# EAGLE design Turing_mini_expander (EAGLE 7.4.0)

## Sheet 1 of 2
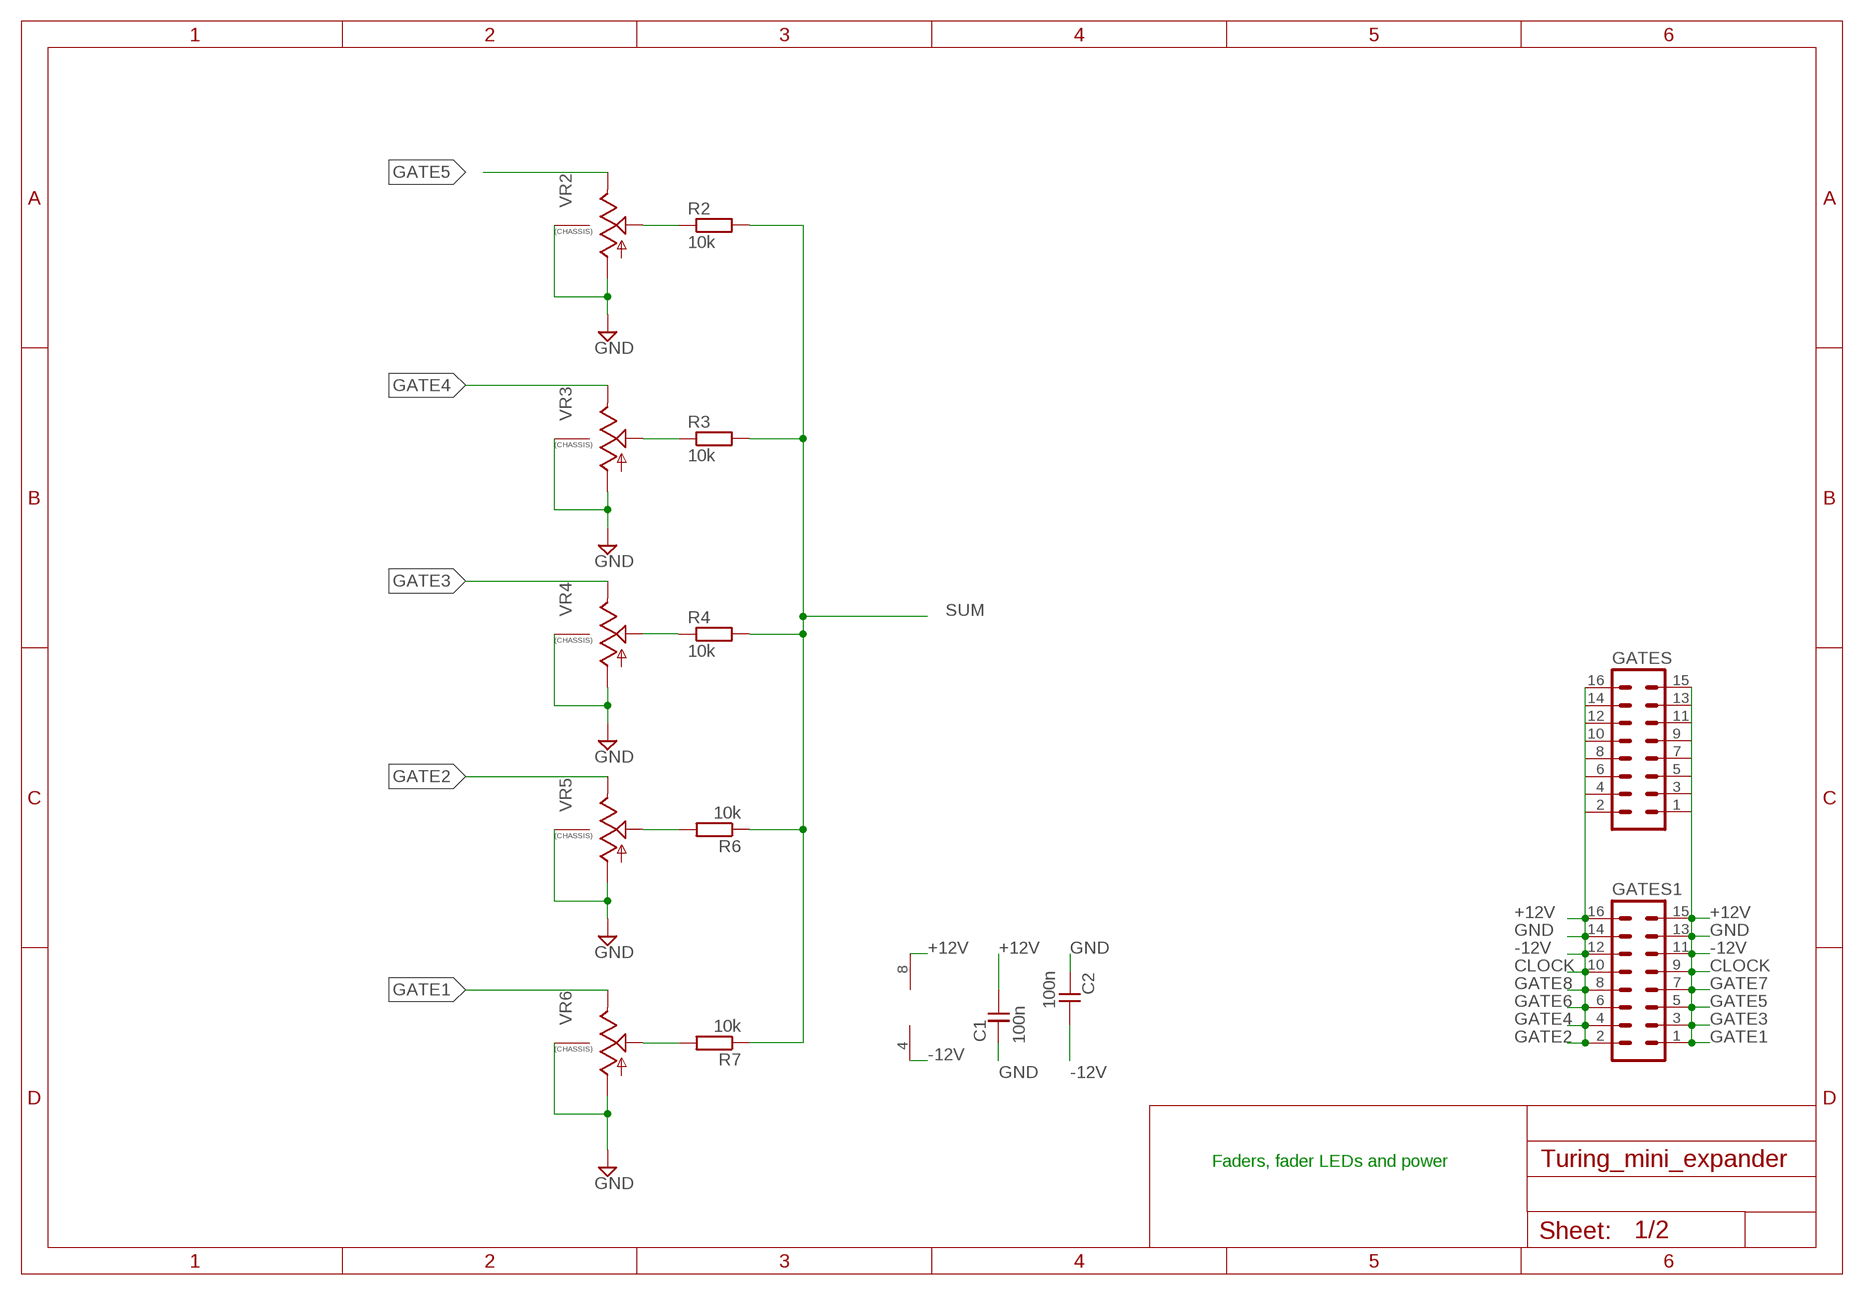
[diagram p0: schematic, sheet 1]

### Parts
C1  100n  C-EU050-024X044  [C050-024X044]
C2  100n  C-EU050-024X044  [C050-024X044]
GATES  MA08-2  [MA08-2]
GATES1  MA08-2  [MA08-2]
R2  10k  RESISTOR7MM  [7MM_RESISTOR]
R3  10k  RESISTOR7MM  [7MM_RESISTOR]
R4  10k  RESISTOR7MM  [7MM_RESISTOR]
R6  10k  RESISTOR7MM  [7MM_RESISTOR]
R7  10k  RESISTOR7MM  [7MM_RESISTOR]
U1  TL072_  [DIL08]
VR2  9MM_SNAP-IN_POT_CHASSIS  [9MM_SNAP-IN_POT]
VR3  9MM_SNAP-IN_POT_CHASSIS  [9MM_SNAP-IN_POT]
VR4  9MM_SNAP-IN_POT_CHASSIS  [9MM_SNAP-IN_POT]
VR5  9MM_SNAP-IN_POT_CHASSIS  [9MM_SNAP-IN_POT]
VR6  9MM_SNAP-IN_POT_CHASSIS  [9MM_SNAP-IN_POT]

### Nets
+12V [power]: C1.1 GATES1.15 GATES1.16 GATES.15 GATES.16 U1.8(P:V+)
-12V [power]: C2.1 GATES1.11 GATES1.12 GATES.11 GATES.12 U1.4(P:V-)
CLOCK: GATES1.9 GATES1.10 GATES.9 GATES.10
GATE1: GATES1.1 GATES.1 VR6.3(E)
GATE2: GATES1.2 GATES.2 VR5.3(E)
GATE3: GATES1.3 GATES.3 VR4.3(E)
GATE4: GATES1.4 GATES.4 VR3.3(E)
GATE5: GATES1.5 GATES.5 VR2.3(E)
GATE6: GATES1.6 GATES.6
GATE7: GATES1.7 GATES.7
GATE8: GATES1.8 GATES.8
GND [ground]: C1.2 C2.2 GATES1.13 GATES1.14 GATES.13 GATES.14 VR2.1(A) VR2.CHASSIS2 VR3.1(A) VR3.CHASSIS2 VR4.1(A) VR4.CHASSIS2 VR5.1(A) VR5.CHASSIS2 VR6.1(A) VR6.CHASSIS2 ; also sheet 2
N$2: R2.1 VR2.2(S)
N$16: R3.1 VR3.2(S)
N$19: R4.1 VR4.2(S)
N$20: R6.2 VR5.2(S)
N$21: R7.2 VR6.2(S)
SUM: R2.2 R3.2 R4.2 R6.1 R7.1 ; also sheet 2

### Notes on the sheet
- Faders, fader LEDs and power

## Sheet 2 of 2
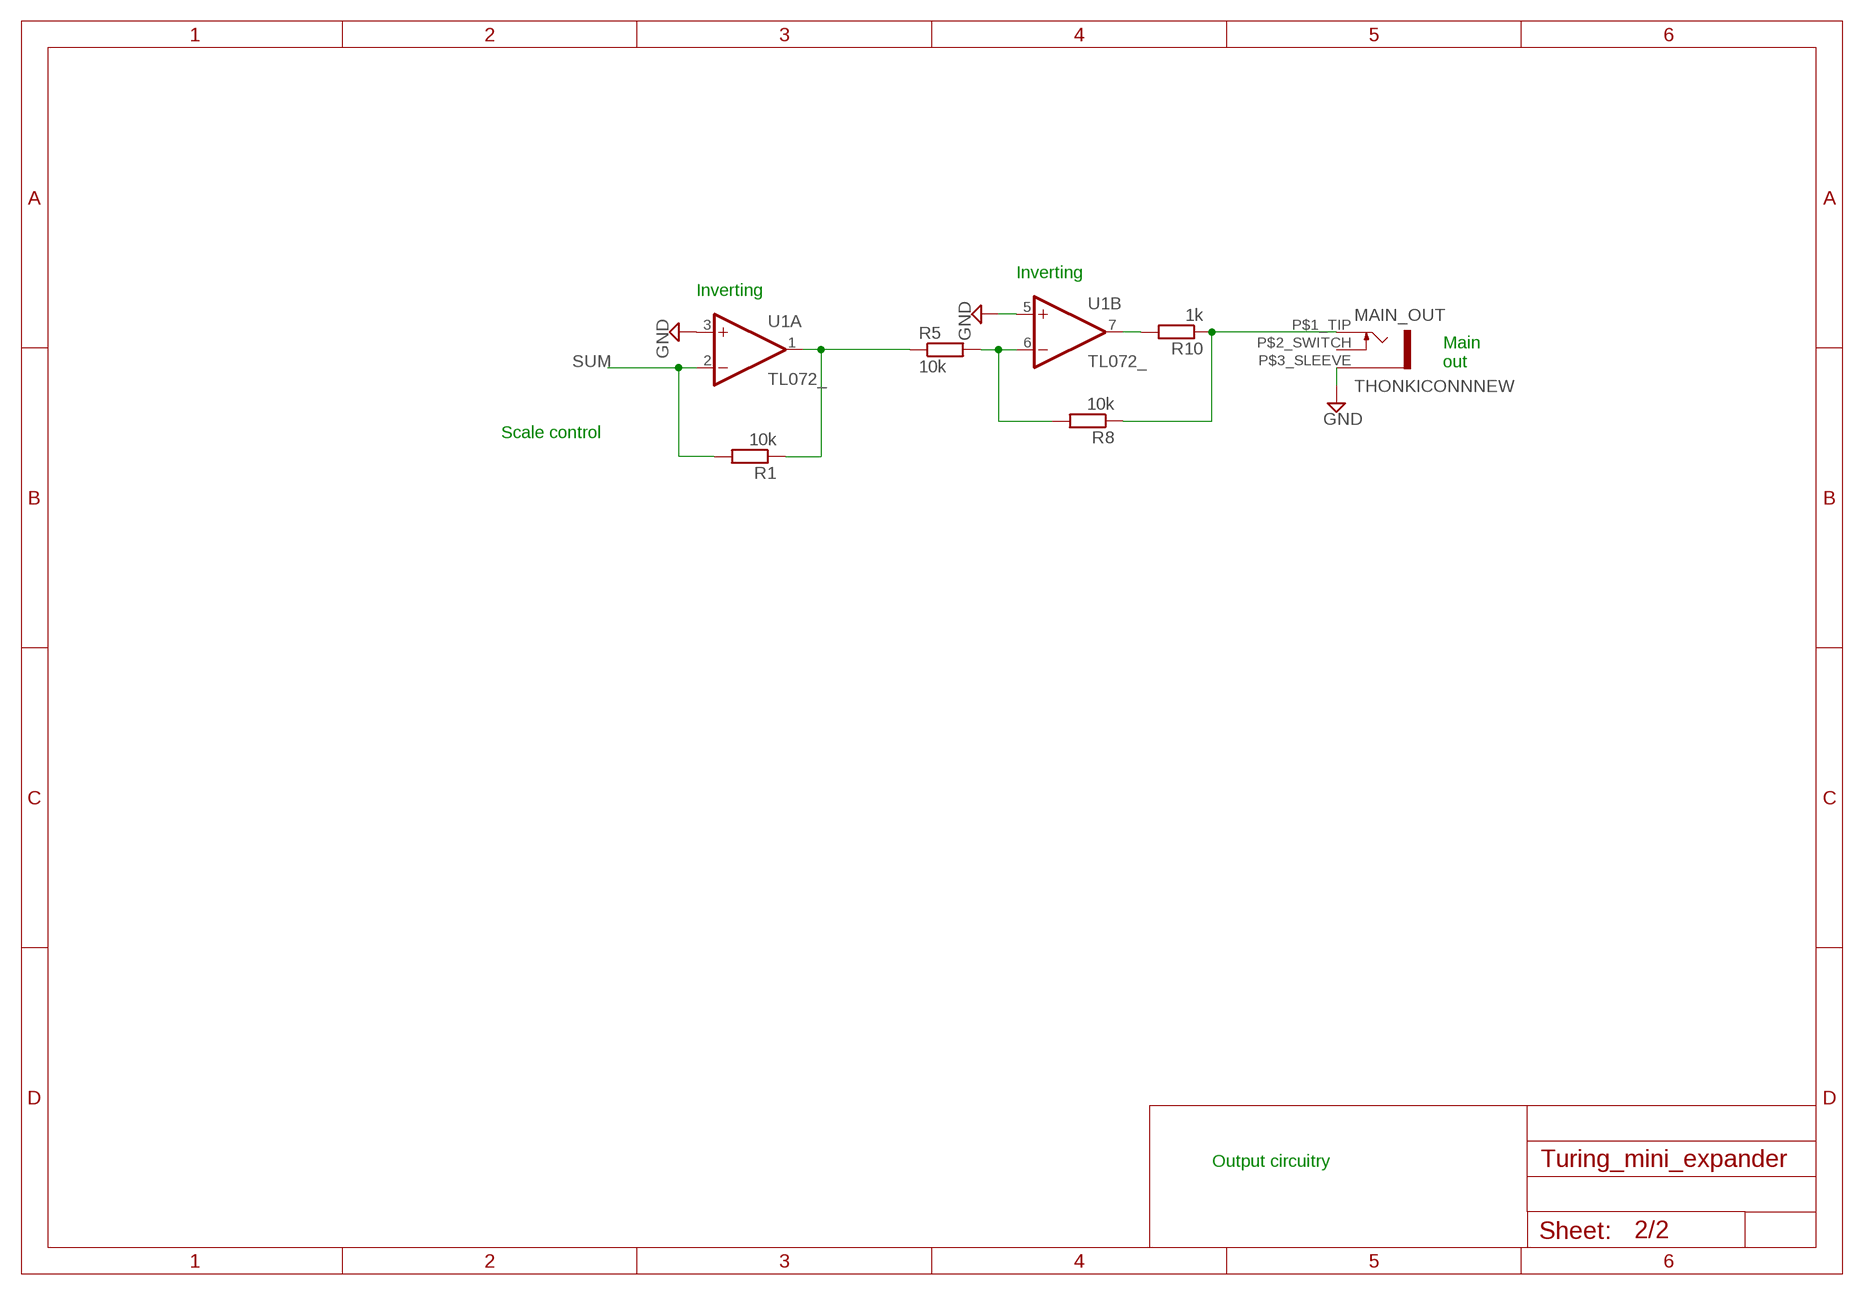
[diagram p1: schematic, sheet 2]

### Parts
MAIN_OUT  THONKICONNNEW  [WQP-PJ301M-12_JACK]
R1  10k  RESISTOR7MM  [7MM_RESISTOR]
R5  10k  RESISTOR7MM  [7MM_RESISTOR]
R8  10k  RESISTOR7MM  [7MM_RESISTOR]
R10  1k  RESISTOR7MM  [7MM_RESISTOR]

### Nets
GND [ground]: MAIN_OUT.P$3_SLEEVE(SLEEVE) U1.3(A:+IN) U1.5(B:+IN) ; also sheet 1
N$4: R5.2 R8.2 U1.6(B:-IN)
N$5: MAIN_OUT.P$1_TIP(TIP) R8.1 R10.1
N$6: R10.2 U1.7(B:OUT)
N$15: R1.1 R5.1 U1.1(A:OUT)
SUM: R1.2 U1.2(A:-IN) ; also sheet 1
Unconnected: MAIN_OUT.P$2_SWITCH(SWITCH)

### Notes on the sheet
- Inverting
- Inverting
- Main
  out
- Scale control
- Output circuitry

## Library data of the parts
C1 C2 = TomW:C-EU: CAPACITOR, European symbol
GATES GATES1 = con-lstb:MA08-2: PIN HEADER; OC_FARNELL: unknown; OC_NEWARK: unknown
MAIN_OUT = MusicThingModular:THONKICONN: 3.5mm socket for Eurorack modular synths
R1-R8 R10 = MusicThingModular:RESISTOR: Standard resistor, various versions
U1 = MusicThingModular:TL072: Generic Dual Op Amp
VR2-VR6 = MusicThingModular:9MM_SNAP-IN_POT_CHASSIS: 9mm vertical snap-in pot, Alpha / Panasonic style, with a connection to the metal chassis for grounding

## Board
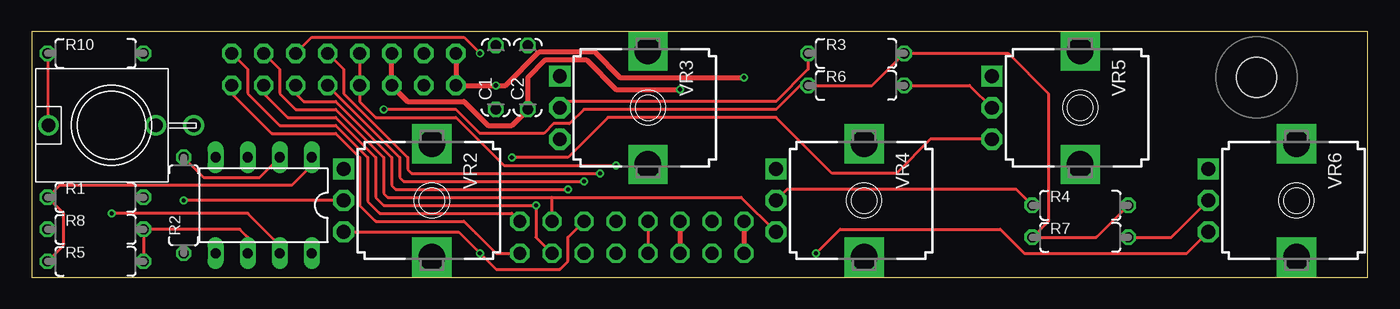
[diagram p2: board, top side]
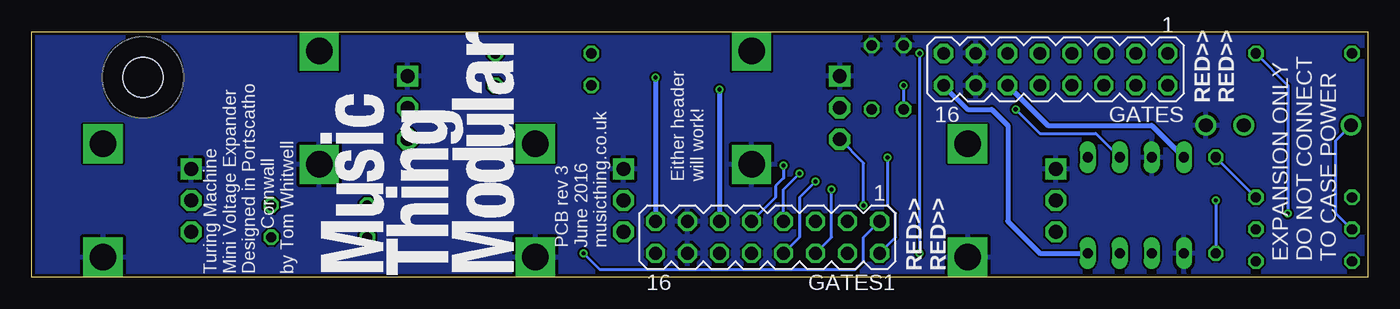
[diagram p3: board, bottom side, seen from below]

Size 106 x 19.5 mm. Coordinates in mm from the lower left corner, seen from the top.
Outline: 0,0 106,0 106,19.5 0,19.5 0,0
Copper layers (1*2*15*16): Top 0.035mm / dielectric 0.2mm / Route2 0.0175mm / dielectric 1.1mm / Route15 0.0175mm / dielectric 0.2mm / Bottom 0.035mm
Design rules "SeeedStudio_DRU_no_angle_20130527": minimum track width 6mil, minimum drill 12mil, track to track 6mil, track to pad 6mil, pad to pad 6mil, via to via 6mil, smd to smd 0mil, copper to edge 10mil, drill to drill 10mil, minimum pad ring 6mil, minimum via ring 6mil, stop-mask expansion 2mil, vias tented up to drill 25mil, thermal gap 10mil

### Footprints (pad centres in the part's own frame; a part is rotated, then mirrored left to right if it is on the bottom)
C050-024X044 = drill 0.813 octagon: 1 -2.54,0; 2 2.54,0
MA08-2 = drill 1.016 octagon: 1 -8.89,-1.27; 2 -8.89,1.27; 3 -6.35,-1.27; 4 -6.35,1.27; 5 -3.81,-1.27; 6 -3.81,1.27; 7 -1.27,-1.27; 8 -1.27,1.27; 9 1.27,-1.27; 10 1.27,1.27; 11 3.81,-1.27; 12 3.81,1.27; 13 6.35,-1.27; 14 6.35,1.27; 15 8.89,-1.27; 16 8.89,1.27
WQP-PJ301M-12_JACK = drill 1.1: P$1_TIP 0,5; P$2_SWITCH 0,-3.5; P$3_SLEEVE 0,-6.5
7MM_RESISTOR = drill 0.813 octagon: 1 -3.81,0; 2 3.81,0
DIL08 = drill 0.813 pad 1.27 long: 1 -3.81,-3.81; 2 -1.27,-3.81; 3 1.27,-3.81; 4 3.81,-3.81; 5 3.81,3.81; 6 1.27,3.81; 7 -1.27,3.81; 8 -3.81,3.81
MOUNTING_HOLE = hole 3.2: 0,0
9MM_SNAP-IN_POT = drill 1.1 pad 1.676 square: 1 -2.5,-7 | drill 1.1 pad 1.676 octagon: 2 0,-7; 3 2.5,-7 | drill 2.1 pad 2.8 square: CHASSIS1 -4.5,0; CHASSIS2 4.5,0

### Placement (x,y rotation side)
C1  36.83,15.88 90 top
C2  39.37,15.88 90 top
GATES  24.77,16.51 180 bottom
GATES1  47.62,3.17 180 bottom
MAIN_OUT  6.35,12.06 90 top
R1  5.08,6.35 0 top
R2  12.06,5.71 90 top
R3  65.41,17.78 0 top
R4  83.19,5.71 0 top
R5  5.08,1.27 0 top
R6  65.41,15.24 0 top
R7  83.19,3.17 0 top
R8  5.08,3.81 0 top
R10  5.08,17.78 0 top
U1  18.41,5.71 180 top
U$1  [MOUNTING_HOLE]  97.16,15.88 0 top
VR2  31.75,6.1 270 top
VR3  48.9,13.46 270 top
VR4  66.04,6.1 270 top
VR5  83.19,13.46 270 top
VR6  100.33,6.1 270 top

### Tracks (layer width: path | path; a pad name or v marks a point on that pad's centre or on a via)
+12V  (via drill 0.33)
  Top 0.406: GATES.15 GATES.16 v36.83,15.24 37.59,15.24 40.26,17.91 44.64,17.91 46.67,15.88 v56.52,15.88 | GATES1.15 GATES1.16
  Bottom 0.254: v36.83,15.24 C1.1
  Bottom 0.406: v56.52,15.88 GATES1.15 | GATES.16 31.75,13.34 29.84,13.34 28.57,12.06 28.57,4.45 26.04,1.91 U1.8
-12V  (via drill 0.33)
  Top 0.406: GATES.11 GATES.12 29.84,13.97 34.29,13.97 36.2,12.06 38.1,12.06 C2.1 39.37,15.88 40.77,17.27 44.01,17.27 46.35,14.92 v51.44,14.92 | GATES1.11 GATES1.12
  Bottom 0.406: v51.44,14.92 GATES1.11 | GATES.12 25.4,12.06 17.14,12.06 U1.4
CLOCK  (via drill 0.33)
  Top 0.254: GATES.9 GATES.10 26.04,13.97 27.3,12.7 33.66,12.7 37.47,8.89 v46.35,8.89 | GATES1.9 GATES1.10
  Bottom 0.254: v46.35,8.89 46.35,7.87 46.99,7.24 46.99,6.35 GATES1.9
GATE1  (via drill 0.33)
  Top 0.254: GATES.1 17.14,16.51 17.14,14.61 19.68,12.06 24.13,12.06 26.67,9.53 26.67,6.03 27.62,5.08 38.1,5.08 GATES1.1 | v62.23,1.91 64.14,3.81 76.83,3.81 78.74,1.91 91.64,1.91 VR6.3
  Bottom 0.254: v62.23,1.91 60.96,0.64 40.64,0.64 40.01,1.27 40.01,3.17 GATES1.1
GATE2  (via drill 0.33)
  Top 0.254: VR5.3 71.29,10.96 68.58,8.26 63.5,8.26 59.05,12.7 45.72,12.7 42.55,9.53 v38.1,9.53 | GATES.2 15.88,14.61 19.05,11.43 24.13,11.43 26.04,9.53 26.04,5.71 27.3,4.45 34.29,4.45 36.83,1.91 GATES1.2
  Bottom 0.254: v38.1,9.53 38.1,5.71 37.47,5.08 37.47,3.17 GATES1.2
GATE3
  Top 0.254: GATES.3 19.68,16.51 19.68,14.61 20.95,13.34 24.13,13.34 27.94,9.53 27.94,6.67 28.26,6.35 41.27,6.35 | 41.27,6.35 56.29,6.35 VR4.3 | GATES1.3 41.27,6.35
GATE4  (via drill 0.33)
  Top 0.254: GATES.4 18.41,14.61 20.32,12.7 24.13,12.7 27.3,9.53 27.3,6.35 27.94,5.71 v40.01,5.71 40.01,3.17 GATES1.4
  Bottom 0.254: v40.01,5.71 40.01,9.07 VR3.3
GATE5  (via drill 0.33)
  Top 0.254: VR2.3 33.87,3.6 v35.56,1.91 36.83,0.64 41.91,0.64 42.55,1.27 42.55,3.17 GATES1.5 | GATES.5 22.23,19.05 34.29,19.05 v35.56,17.78
  Bottom 0.254: v35.56,17.78 v35.56,1.91
GATE6  (via drill 0.33)
  Top 0.254: GATES.6 20.95,14.61 21.59,13.97 24.13,13.97 28.57,9.53 28.57,7.3 28.89,6.99 v42.55,6.99
  Bottom 0.254: GATES1.6 42.55,3.17 v42.55,6.99
GATE7  (via drill 0.33)
  Top 0.254: GATES.7 24.77,16.51 24.77,14.61 29.84,9.53 29.84,8.57 30.16,8.26 v45.09,8.26
  Bottom 0.254: GATES1.7 46.35,6.99 v45.09,8.26
GATE8  (via drill 0.33)
  Top 0.254: GATES.8 29.21,9.53 29.21,7.94 29.53,7.62 v43.81,7.62
  Bottom 0.254: v43.81,7.62 45.09,6.35 45.09,3.17 GATES1.8
GND
  pour Bottom: -1.27,-2.54 106.05,-2.54 106.05,21.59 -1.27,21.59
N$2  (via drill 0.33)
  Top 0.254: VR2.2 v12.06,6.1
  Bottom 0.254: v12.06,6.1 R2.1
N$4
  Top 0.254: U1.6 17.14,3.17 16.51,3.81 R8.2 R5.2
N$5
  Top 0.254: R10.1 1.27,12.14 MAIN_OUT.P$1_TIP
  Bottom 0.254: R8.1 2.54,5.08 2.54,10.88 MAIN_OUT.P$1_TIP
N$6  (via drill 0.33)
  Top 0.254: U1.7 19.68,2.54 17.14,5.08 v6.35,5.08
  Bottom 0.254: R10.2 6.35,15.24 v6.35,5.08
N$15
  Top 0.254: U1.1 22.23,8.89 20.64,7.3 2.22,7.3 R1.1 2.54,5.08 2.54,2.54 R5.1
N$16
  Top 0.254: R3.1 61.59,16.51 59.05,13.97 42.4,13.97 VR3.2
N$19
  Top 0.254: R4.1 78.11,6.99 59.93,6.99 VR4.2
N$20
  Top 0.254: R6.2 74.41,15.24 VR5.2
N$21
  Top 0.254: R7.2 90.41,3.17 VR6.2
SUM  (via drill 0.33)
  Top 0.254: R4.2 84.45,3.17 R7.1 80.64,4.45 80.64,14.61 77.47,17.78 R3.2 66.67,15.24 R6.1 60.96,15.24 59.05,13.34 43.81,13.34 42.67,12.19 41.4,12.19 40.64,11.43 35.56,11.43 33.66,13.34 v27.94,13.34 | R2.2 13.65,7.94 18.1,7.94 U1.2
  Bottom 0.254: v27.94,13.34 26.04,11.43 21.59,11.43 U1.2 | R1.2 R2.2

### Text on the board
bPlace: RED>> / RED>> | Either header / will work! | PCB rev 3 / June 2016 / musicthing.co.uk | EXPANSION ONLY / DO NOT CONNECT / TO CASE POWER | RED>> / RED>> | Turing Machine / Mini Voltage Expander / Designed in Portscatho / Cornwall / by Tom Whitwell